# Altium project BopIt.PrjPcb
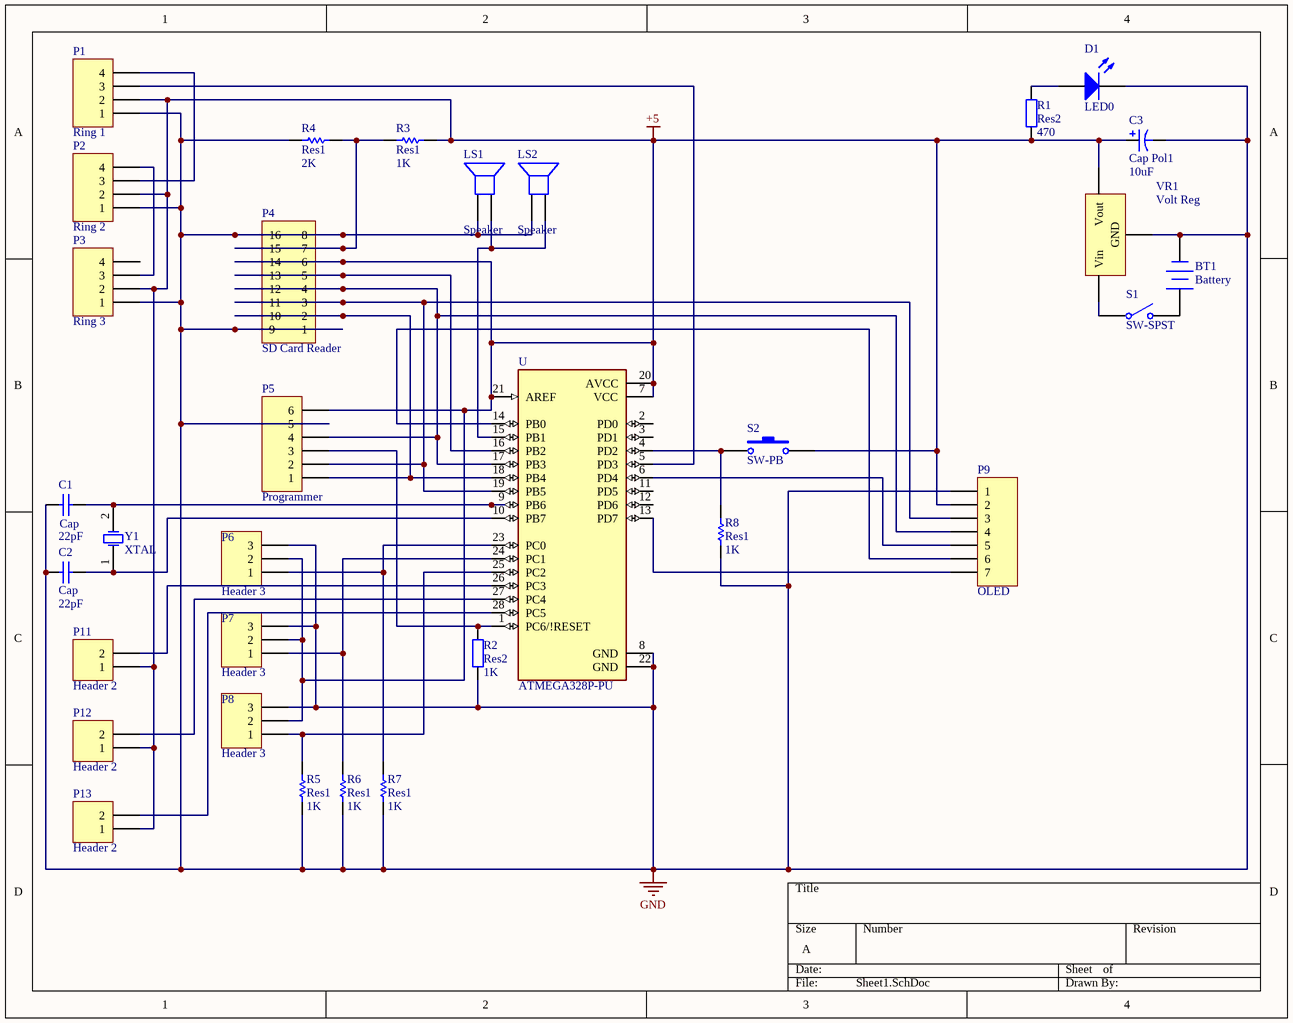
[diagram p0: Sheet1.SchDoc]
2 sheets, 35 parts. Net scope: global (net labels, ports and power ports of the same name join across sheets).
Board files: PCB1.PcbDoc, PCB2.PcbDoc
Sheets:
  Sheet1.SchDoc
  Sheet2.SchDoc

## Sheet Sheet1.SchDoc
size A; SheetNumber: 1; SheetTotal: 2

### Parts
BT1  Battery  [BAT-2]
C1  Cap  value 22pF  [RAD-0.3]
C2  Cap  value 22pF  [RAD-0.3]
C3  Cap Pol1  value 10uF  [RB7.6-15]
D1  LED0  [LED-0]
LS1  Speaker  [PIN2]
LS2  Speaker  [PIN2]
P1  Ring 1  [HDR1X4]
P2  Ring 2  [HDR1X4]
P3  Ring 3  [HDR1X4]
P4  SD Card Reader  [HDR2X8_CEN]
P5  Programmer  [HDR1X6]
P6  Header 3  [HDR1X3]
P7  Header 3  [HDR1X3]
P8  Header 3  [HDR1X3]
P9  OLED  [HDR1X7]
P11  Header 2  [HDR1X2]
P12  Header 2  [HDR1X2]
P13  Header 2  [HDR1X2]
R1  Res2  value 470  [AXIAL-0.4]
R2  Res2  value 1K  [AXIAL-0.4]
R3  Res1  value 1K  [AXIAL-0.3]
R4  Res1  value 2K  [AXIAL-0.3]
R5  Res1  value 1K  [AXIAL-0.3]
R6  Res1  value 1K  [AXIAL-0.3]
R7  Res1  value 1K  [AXIAL-0.3]
R8  Res1  value 1K  [AXIAL-0.3]
S1  SW-SPST  [SPST-2]
S2  SW-PB  [SPST-2]
U  ATMEGA328P-PU  [DIP794W46P254L2967H457Q28B]
VR1  Volt Reg  [D2PAK_N]
Y1  XTAL  [R38]

### Nets
+5: C3.1 P1.2 P2.2 P3.2 P4.6 P4.14 P5.6 P6.2 P7.2 P8.2 P9.2 P11.1 P12.1 P13.1 R1.1 R3.2 S2.2 U.7(VCC) U.20(AVCC) U.21(AREF) VR1.3(Vout)
GND: BT1.2(-) C1.1 C2.1 C3.2 D1.2(K) LS1.1 LS2.1 P1.1 P2.1 P3.1 P4.1 P4.8 P4.9 P4.16 P5.5 P6.3 P7.3 P8.3 P9.1 R2.2 R4.1 R5.1 R6.1 R7.1 R8.1 U.8(GND) U.22(GND) VR1.2(GND)
NetBT1_1: BT1.1(+) S1.2(NO)
NetC1_2: C1.2 U.9(PB6) Y1.2(OSC2)
NetC2_2: C2.2 U.10(PB7) Y1.1(OSC1)
NetD1_1: D1.1(A) R1.2
NetLS1_2: LS1.2 LS2.2 U.15(PB1)
NetP1_3: P1.3 U.5(PD3)
NetP1_4: P1.4 P2.3
NetP2_4: P2.4 P3.3
NetP4_2: P4.2 P4.10 P5.1 U.18(PB4)
NetP4_3: P4.3 P4.11 P5.2 P9.3 U.19(PB5)
NetP4_4: P4.4 P4.12 P5.4 P9.4 U.17(PB3)
NetP4_5: P4.5 P4.13 U.16(PB2)
NetP4_7: P4.7 P4.15 R3.1 R4.2
NetP5_3: P5.3 R2.1 U.1(PC6/!RESET)
NetP6_1: P6.1 R7.2 U.23(PC0)
NetP7_1: P7.1 R6.2 U.24(PC1)
NetP8_1: P8.1 R5.2 U.25(PC2)
NetP9_5: P9.5 U.6(PD4)
NetP9_6: P9.6 U.14(PB0)
NetP9_7: P9.7 U.13(PD7)
NetP11_2: P11.2 U.26(PC3)
NetP12_2: P12.2 U.27(PC4)
NetP13_2: P13.2 U.28(PC5)
NetR8_2: R8.2 S2.1 U.4(PD2)
NetS1_1: S1.1(COMMON) VR1.1(Vin)

Not connected (* = marked no-connect by the designer): P3 4; U 2(PD0) 3(PD1) 11(PD5) 12(PD6)

### Library data of the parts
BT1 = Battery: Multicell Battery; Published: 24-Mar-1999; LatestRevisionDate: 17-Jul-2002; LatestRevisionNote: Re-released for DXP Platform.; PackageReference: BAT-2; Publisher: Altium Limited; PackageDescription: Battery; 2 Leads
C1 C2 = Cap: Capacitor; Published: 8-Jun-2000; LatestRevisionDate: 17-Jul-2002; LatestRevisionNote: Re-released for DXP Platform.; PackageReference: RAD-0.3; Publisher: Altium Limited; PackageDescription: Radial Cap, Thru-Hole; 2 Leads; 0.3 in Pin Spacing
C3 = Cap Pol1: Polarized Capacitor (Radial); Published: 8-Jun-2000; LatestRevisionDate: 17-Jul-2002; LatestRevisionNote: Re-released for DXP Platform.; PackageReference: RB7.6-15; Publisher: Altium Limited; PackageDescription: Polarized Capacitor (Radial); 2 Leads
D1 = LED0: Typical INFRARED GaAs LED; Published: 8-Jun-2000; LatestRevisionDate: 08-Jul-2005; LatestRevisionNote: Mech Layer 1 removed.; PackageReference: LED-0; Publisher: Altium Limited; PackageDescription: LED; 2 Leads
LS1 LS2 = Speaker: Loudspeaker; Published: 24-Mar-1999; LatestRevisionDate: 17-Jul-2002; LatestRevisionNote: Re-released for DXP Platform.; PackageReference: PIN2; Publisher: Altium Limited
P1-P3 = Header 4: Header, 4-Pin; LatestRevisionDate: 17-Jul-2002; LatestRevisionNote: Re-released for DXP Platform.; Publisher: Altium Limited
P4 = Header 8X2A: Header, 8-Pin, Dual row; LatestRevisionDate: 17-Jul-2002; LatestRevisionNote: Re-released for DXP Platform.; Publisher: Altium Limited
P5 = Header 6: Header, 6-Pin; LatestRevisionDate: 17-Jul-2002; LatestRevisionNote: Re-released for DXP Platform.; Publisher: Altium Limited
P6-P8 = Header 3: Header, 3-Pin; LatestRevisionDate: 17-Jul-2002; LatestRevisionNote: Re-released for DXP Platform.; Publisher: Altium Limited
P9 = Header 7: Header, 7-Pin; LatestRevisionDate: 17-Jul-2002; LatestRevisionNote: Re-released for DXP Platform.; Publisher: Altium Limited
P11-P13 = Header 2: Header, 2-Pin; LatestRevisionDate: 17-Jul-2002; LatestRevisionNote: Re-released for DXP Platform.; Publisher: Altium Limited
R1 R2 = Res2: Resistor; Published: 8-Jun-2000; LatestRevisionDate: 17-Jul-2002; LatestRevisionNote: Re-released for DXP Platform.; PackageReference: AXIAL-0.4; Publisher: Altium Limited; PackageDescription: Axial Device, Thru-Hole; 2 Leads; 0.4 in Pin Spacing
R3-R8 = Res1: Resistor; Published: 8-Jun-2000; LatestRevisionDate: 17-Jul-2002; LatestRevisionNote: Re-released for DXP Platform.; PackageReference: AXIAL-0.3; Publisher: Altium Limited; PackageDescription: Axial Device, Thru-Hole; 2 Leads; 0.3 in Pin Spacing
S1 = SW-SPST: Single-Pole, Single-Throw Switch; Published: 24-Mar-1999; LatestRevisionDate: 17-Jul-2002; LatestRevisionNote: Re-released for DXP Platform.; PackageReference: SPST-2; Publisher: Altium Limited; PackageDescription: Switch; 2 Leads
S2 = SW-PB: Switch; Published: 24-Mar-1999; LatestRevisionDate: 17-Jul-2002; LatestRevisionNote: Re-released for DXP Platform.; PackageReference: SPST-2; Publisher: Altium Limited; PackageDescription: Switch; 2 Leads
U = ATMEGA328P-PU: AVR AVRÂ® ATmega Microcontroller IC 8-Bit 20MHz 32KB _16K x 16_ FLASH 28-PDIP; MF: Microchip; Package: PDIP-28 Atmel; Value: *; Availability: Unavailable; SnapEDA_Link: https://www.snapeda.com/parts/ATMEGA328P-PU/Microchip/view-part/44282/?ref=snap; Price: None; MP: ATMEGA328P-PU
VR1 = Volt Reg: Voltage Regulator; Published: 24-Mar-1999; LatestRevisionDate: 29-May-2009; LatestRevisionNote: IPC-7351 Footprint Added.; PackageReference: D2PAK; Publisher: Altium Limited; PackageDescription: 3-Pin Transistor Outline Package 2.54 mm Pitch, 15.1 mm Lead Span
Y1 = XTAL: Crystal Oscillator; Published: 8-Jun-2000; LatestRevisionDate: 17-Jul-2002; LatestRevisionNote: Re-released for DXP Platform.; PackageReference: R38; Publisher: Altium Limited; PackageDescription: Crystal, Thru-Hole; 2 Leads; Body 3.1 x 8.2 mm (Dia.xH)

## Sheet Sheet2.SchDoc
size A; SheetNumber: 2; SheetTotal: 2
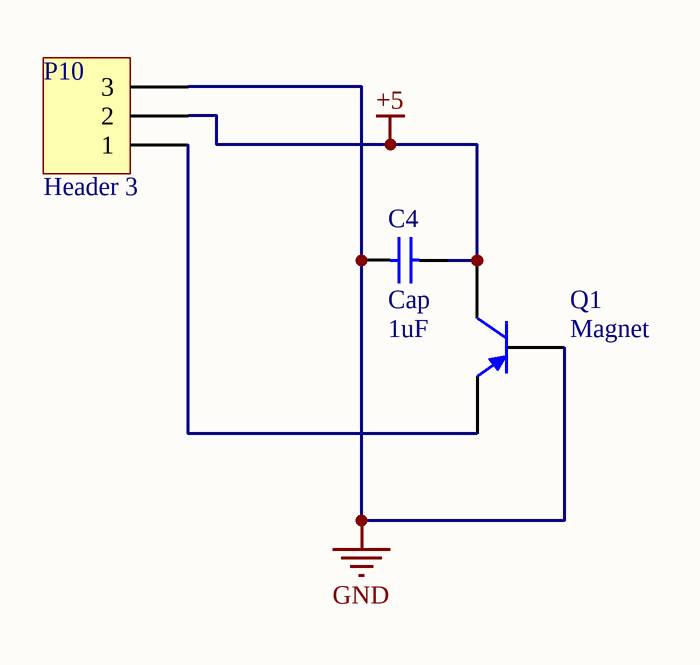
[diagram p1: Sheet2.SchDoc]

### Parts
C4  Cap  value 1uF  [RAD-0.3]
P10  Header 3  [HDR1X3]
Q1  Magnet  [SOT-23B_N]

### Nets
+5: C4.2 P10.2 Q1.1(B)
GND: C4.1 P10.3 Q1.2(E)
NetP10_1: P10.1 Q1.3(C)

### Library data of the parts
C4 = Cap: Capacitor; Published: 8-Jun-2000; LatestRevisionDate: 17-Jul-2002; LatestRevisionNote: Re-released for DXP Platform.; PackageReference: RAD-0.3; Publisher: Altium Limited; PackageDescription: Radial Cap, Thru-Hole; 2 Leads; 0.3 in Pin Spacing
P10 = Header 3: Header, 3-Pin; LatestRevisionDate: 17-Jul-2002; LatestRevisionNote: Re-released for DXP Platform.; Publisher: Altium Limited
Q1 = PNP: PNP Bipolar Transistor; Published: 8-Jun-2000; LatestRevisionDate: 29-May-2009; LatestRevisionNote: IPC-7351 Footprint Added.; PackageVersion: Aug-1999; PackageReference: SOT-23B; Publisher: Altium Limited; PackageDescription: 3-Pin SOT-23 Package 0.95 mm Pitch, 2.4 mm Lead Span

## Nets that join several sheets
+5: Sheet1 (21 pins), Sheet2 (C4.2 P10.2 Q1.1)
GND: Sheet1 (28 pins), Sheet2 (C4.1 P10.3 Q1.2)